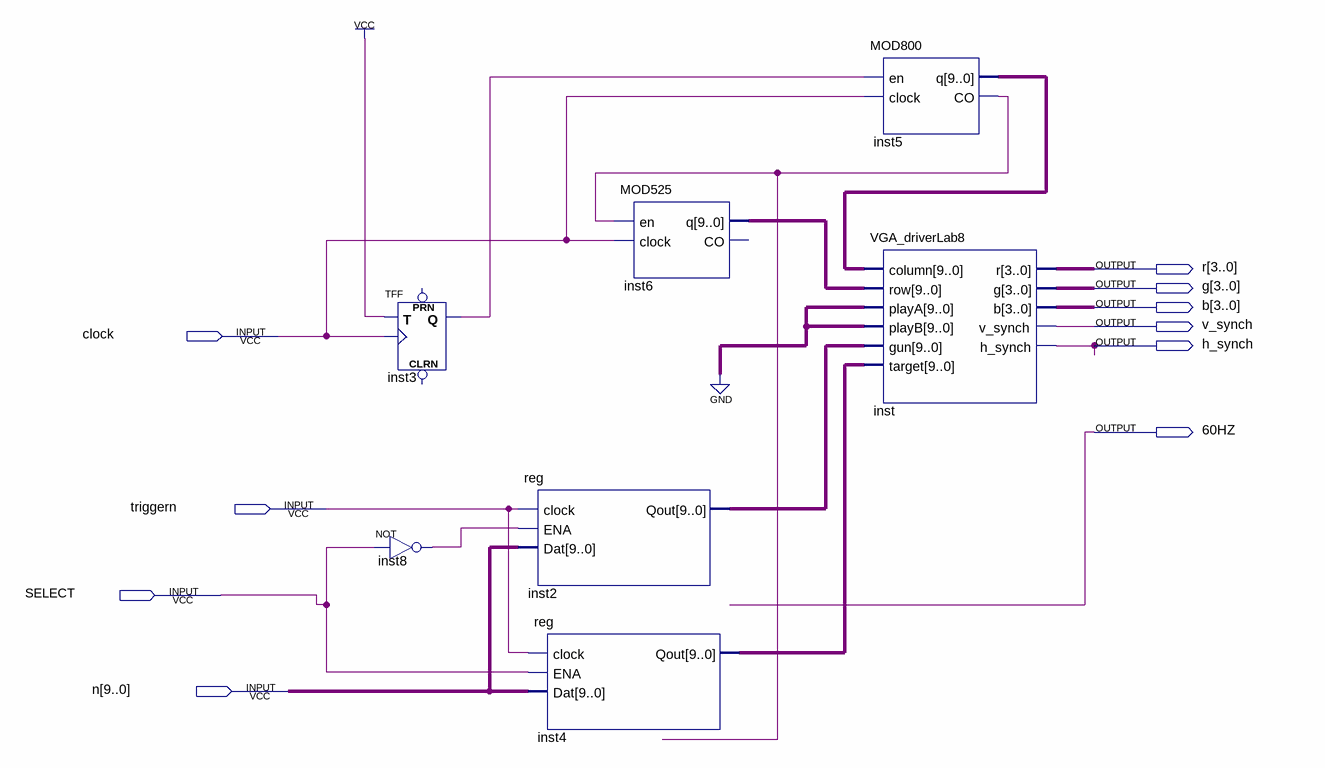
[diagram p0: schematic sheet]
// Quartus schematic system.bdf as structural Verilog: 7 symbols, 10 pins
module system (
  input  clock,
  input  triggern,
  input  SELECT,
  input  [9:0] n,
  output [3:0] r,
  output [3:0] g,
  output [3:0] b,
  output v_synch,
  output h_synch,
  output \60HZ 
);

  wire inst3_q, inst5_co, inst8_out;
  wire [9:0] inst2_qout, inst4_qout, inst5_q, inst6_q;

  TFF inst3 (.T(1'b1), .CLK(clock), .Q(inst3_q));  // open: PRN, CLRN
  not inst8 (inst8_out, SELECT);
  \reg  inst2 (.clock(triggern), .ENA(inst8_out), .Dat(n), .Qout(inst2_qout));
  \reg  inst4 (.clock(triggern), .ENA(SELECT), .Dat(n), .Qout(inst4_qout));
  MOD525 inst6 (.en(inst5_co), .clock(clock), .q(inst6_q));  // open: CO
  MOD800 inst5 (.en(inst3_q), .clock(clock), .q(inst5_q), .CO(inst5_co));
  VGA_driverLab8 inst (
    .column(inst5_q), .row(inst6_q), .playA({10{1'b0}}), .playB({10{1'b0}}), .gun(inst2_qout),
    .target(inst4_qout), .r(r), .g(g), .b(b), .v_synch(v_synch), .h_synch(h_synch));
endmodule
